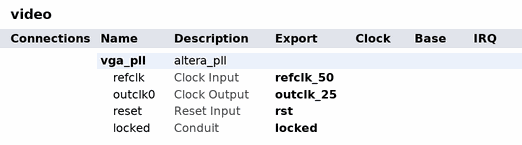
[diagram p0: system contents]
# Platform Designer (Qsys) system video, Cyclone V 5CSEBA6U23I7
# Parameters at their usual value, and those the tool derives, are not listed.
package require -exact qsys 18.1
create_system video
set_project_property DEVICE_FAMILY {Cyclone V}
set_project_property DEVICE 5CSEBA6U23I7

add_instance vga_pll altera_pll 18.1
set_instance_parameter_value vga_pll gui_device_speed_grade 1
set_instance_parameter_value vga_pll gui_number_of_clocks 1
set_instance_parameter_value vga_pll gui_operation_mode direct
set_instance_parameter_value vga_pll gui_output_clock_frequency0 25.175
set_instance_parameter_value vga_pll gui_pll_mode {Integer-N PLL}
set_instance_parameter_value vga_pll gui_reference_clock_frequency 50.0
set_instance_parameter_value vga_pll gui_use_locked true

# exported interfaces
add_interface locked conduit end
set_interface_property locked EXPORT_OF vga_pll.locked
add_interface outclk_25 clock source
set_interface_property outclk_25 EXPORT_OF vga_pll.outclk0
add_interface refclk_50 clock sink
set_interface_property refclk_50 EXPORT_OF vga_pll.refclk
add_interface rst reset sink
set_interface_property rst EXPORT_OF vga_pll.reset

set_interconnect_requirement {$system} qsys_mm.clockCrossingAdapter HANDSHAKE
set_interconnect_requirement {$system} qsys_mm.enableEccProtection FALSE
set_interconnect_requirement {$system} qsys_mm.insertDefaultSlave FALSE
set_interconnect_requirement {$system} qsys_mm.maxAdditionalLatency 1

save_system video.qsys
